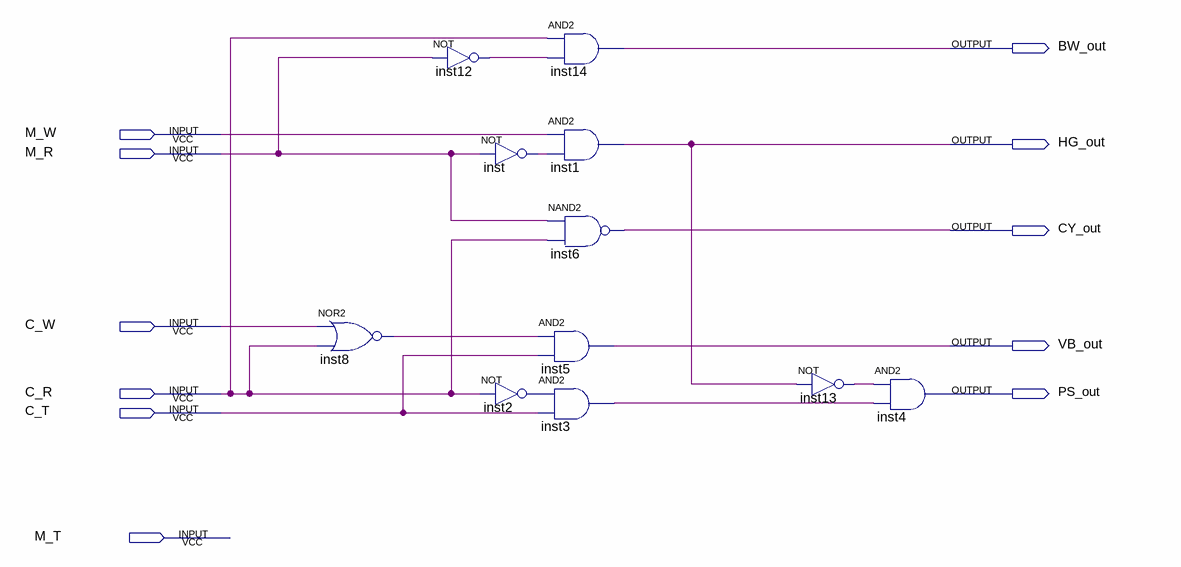
[diagram p0: schematic sheet]
// Quartus schematic ActivitySuggestions.bdf as structural Verilog: 11 symbols, 11 pins
module ActivitySuggestions (
  input  M_W,
  input  M_R,
  input  C_W,
  input  C_R,
  input  C_T,
  input  M_T,
  output BW_out,
  output HG_out,
  output CY_out,
  output VB_out,
  output PS_out
);

  wire inst2_out, inst3_out, inst8_out, inst12_out, inst13_out, inst_out;

  nor inst8 (inst8_out, C_W, C_R);
  not inst12 (inst12_out, M_R);
  not inst (inst_out, M_R);
  and inst5 (VB_out, inst8_out, C_T);
  not inst2 (inst2_out, C_R);
  and inst3 (inst3_out, inst2_out, C_T);
  and inst14 (BW_out, C_R, inst12_out);
  and inst1 (HG_out, M_W, inst_out);
  nand inst6 (CY_out, M_R, C_R);
  not inst13 (inst13_out, HG_out);
  and inst4 (PS_out, inst13_out, inst3_out);
endmodule
